# Altium schematic sheet Power_driver_power.SchDoc: Программируемый испочник напряжения
size 420 x 297 mm; ApprovedBy: Kurochkin; CheckedBy: Pavlov; Author: Ponomarev; CompanyName: RQC; DocumentNumber: РТСБ.XXXXXX.XXX Э3; SheetNumber: 1; SheetTotal: 2; DocumentType: Схема электрическая принципиальная; FirstReferrence: АБВГ.123456.001
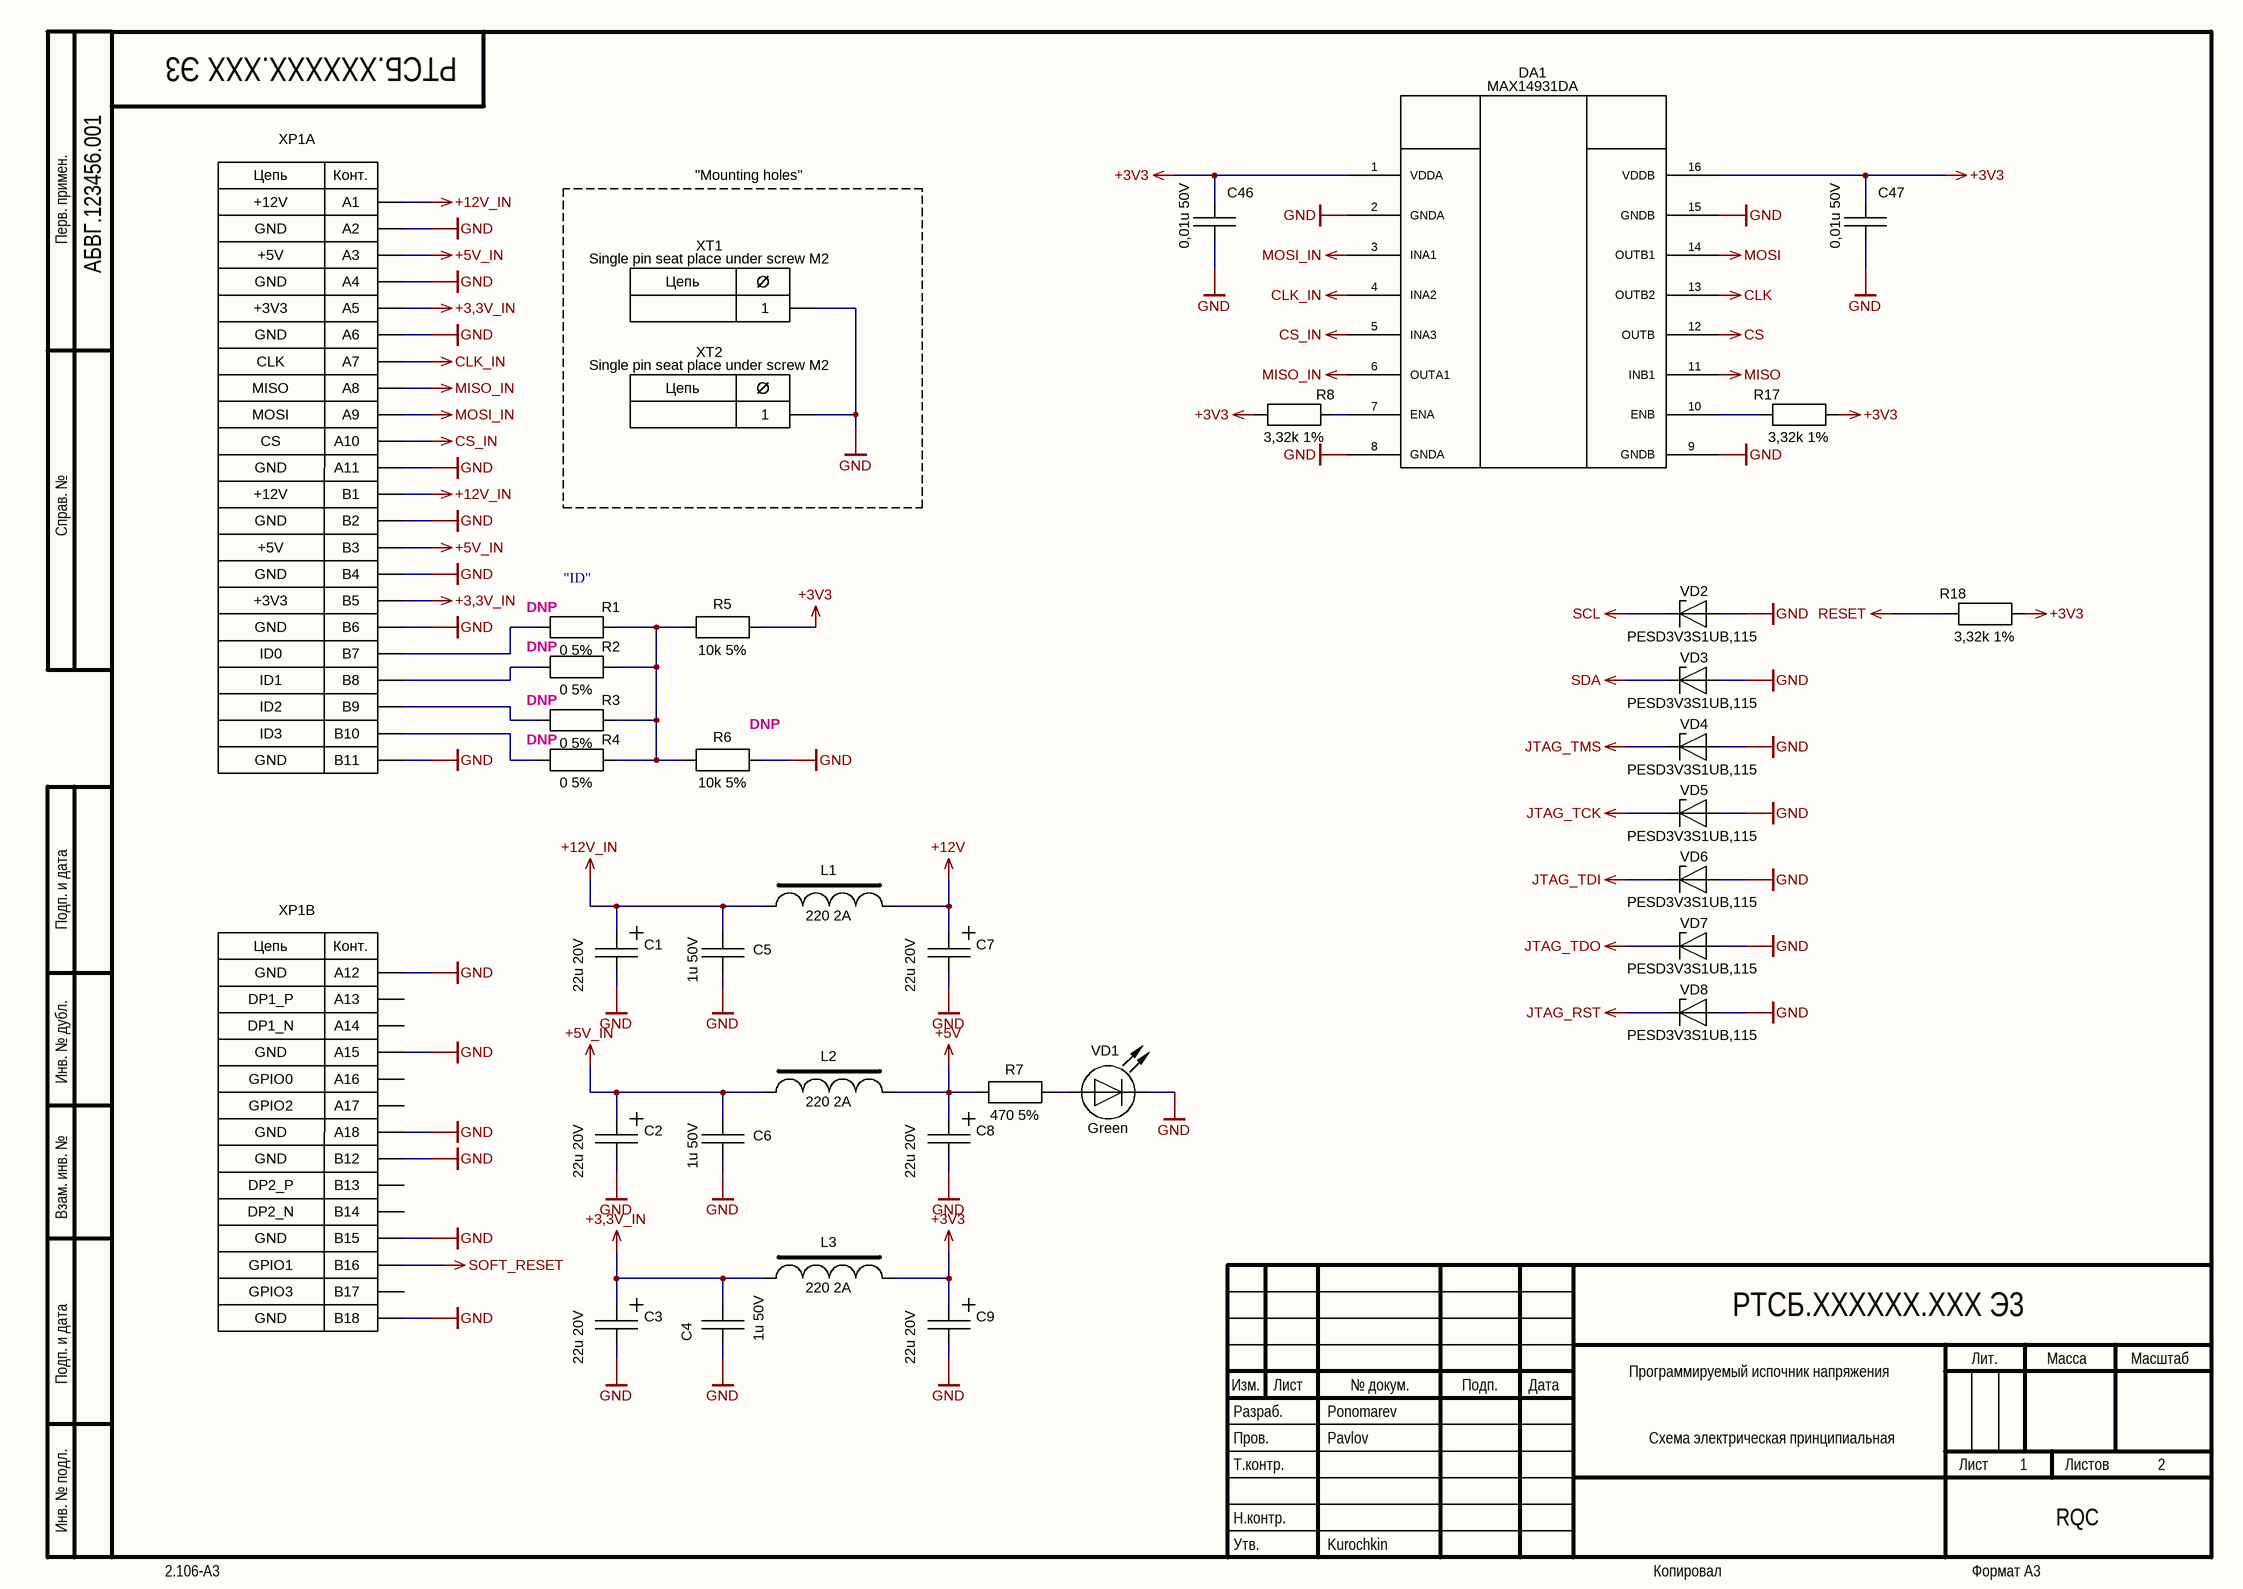
[diagram p0: Power_driver_power.SchDoc]

## Parts
C1  22u 20V  [B_CAPMP3528X21N]
C2  22u 20V  [B_CAPMP3528X21N]
C3  22u 20V  [B_CAPMP3528X21N]
C4  1u 50V  [C0603_CAPC1608X09N]
C5  1u 50V  [C0603_CAPC1608X09N]
C6  1u 50V  [C0603_CAPC1608X09N]
C7  22u 20V  [B_CAPMP3528X21N]
C8  22u 20V  [B_CAPMP3528X21N]
C9  22u 20V  [B_CAPMP3528X21N]
C46  0,01u 50V  [C0603_CAPC1608X09N]
C47  0,01u 50V  [C0603_CAPC1608X09N]
DA1  MAX14931DA  [SOIC127P740X110-16N]
L1  220 2A  [I0805_INDC2012X11N]
L2  220 2A  [I0805_INDC2012X11N]
L3  220 2A  [I0805_INDC2012X11N]
R1  0 5%  Staff: DNP  [R0603_RESC1608X06N]
R2  0 5%  Staff: DNP  [R0603_RESC1608X06N]
R3  0 5%  Staff: DNP  [R0603_RESC1608X06N]
R4  0 5%  Staff: DNP  [R0603_RESC1608X06N]
R5  10k 5%  [R0603_RESC1608X06N]
R6  10k 5%  Staff: DNP  [R0603_RESC1608X06N]
R7  470 5%  [R0603_RESC1608X06N]
R8  3,32k 1%  [R0603_RESC1608X06N]
R17  3,32k 1%  [R0603_RESC1608X06N]
R18  3,32k 1%  [R0603_RESC1608X06N]
VD1  Green  [LED3010X012]
VD2  PESD3V3S1UB,115  [SOD523_SODFL160X65-2N]
VD3  PESD3V3S1UB,115  [SOD523_SODFL160X65-2N]
VD4  PESD3V3S1UB,115  [SOD523_SODFL160X65-2N]
VD5  PESD3V3S1UB,115  [SOD523_SODFL160X65-2N]
VD6  PESD3V3S1UB,115  [SOD523_SODFL160X65-2N]
VD7  PESD3V3S1UB,115  [SOD523_SODFL160X65-2N]
VD8  PESD3V3S1UB,115  [SOD523_SODFL160X65-2N]
XP1  (no value)  [PCI_EXP_36_EDGE_mod]  (parts A,B of 2)  (no BOM)
XT1  Single pin seat place under screw M2  [S_MOUNT_M2]
XT2  Single pin seat place under screw M2  [S_MOUNT_M2]

## Blocks framed on the sheet
"Mounting holes": XT1 XT2

## Nets
+3,3V_IN: C3.1 C4.2 L3.1 XP1.A5 XP1.B5
+3V3: C9.1 C46.1 C47.1 DA1.1(VDDA) DA1.16(VDDB) L3.2 R5.2 R8.1 R17.1 R18.1
+5V: C8.1 L2.2 R7.1
+5V_IN: C2.1 C6.2 L2.1 XP1.A3 XP1.B3
+12V: C7.1 L1.2
+12V_IN: C1.1 C5.2 L1.1 XP1.A1 XP1.B1
CLK: DA1.13(OUTB2)
CLK_IN: DA1.4(INA2) XP1.A7
CS: DA1.12(OUTB)
CS_IN: DA1.5(INA3) XP1.A10
GND: C1.2 C2.2 C3.2 C4.1 C5.1 C6.1 C7.2 C8.2 C9.2 C46.2 C47.2 DA1.2(GNDA) DA1.8(GNDA) DA1.9(GNDB) DA1.15(GNDB) R6.2 VD1.1(K) VD2.2(A) VD3.2(A) VD4.2(A) VD5.2(A) VD6.2(A) VD7.2(A) VD8.2(A) XP1.A2 XP1.A4 XP1.A6 XP1.A11 XP1.A12 XP1.A15 XP1.A18 XP1.B2 XP1.B4 XP1.B6 XP1.B11 XP1.B12 XP1.B15 XP1.B18 XT1.1 XT2.1
JTAG_RST: VD8.1(K)
JTAG_TCK: VD5.1(K)
JTAG_TDI: VD6.1(K)
JTAG_TDO: VD7.1(K)
JTAG_TMS: VD4.1(K)
MISO: DA1.11(INB1)
MISO_IN: DA1.6(OUTA1) XP1.A8
MOSI: DA1.14(OUTB1)
MOSI_IN: DA1.3(INA1) XP1.A9
RESET: R18.2
SCL: VD2.1(K)
SDA: VD3.1(K)
SOFT_RESET: XP1.B16
NetDA1_7: DA1.7(ENA) R8.2
NetDA1_10: DA1.10(ENB) R17.2
NetR1_1: R1.1 XP1.B7
NetR1_2: R1.2 R2.2 R3.2 R4.2 R5.1 R6.1
NetR2_1: R2.1 XP1.B8
NetR3_1: R3.1 XP1.B9
NetR4_1: R4.1 XP1.B10
NetR7_2: R7.2 VD1.2(A)

Not connected (* = marked no-connect by the designer): XP1 A13 A14 A16 A17 B13 B14 B17

## Notes on the sheet
- (near R1) "ID"
- Перв. примен.
- Справ. №
- Подп. и дата
- Инв. № дубл.
- Взам. инв. №
- Разраб.
- Изм.
- Лист
- № докум.
- Подп.
- Дата
- Лит.
- Масса
- Масштаб
- Пров.
- Т.контр.
- Листов
- Инв. № подл.
- Утв.
- Н.контр.
- 2.106-A3
- Копировал
- Формат А3
- (in symbol PCI_EXP_36_EDGE_mod, part A) Цепь; Конт.; +12V; GND; +5V; +3V3; CLK; MISO; MOSI; CS; ID0; ID1; ID2; ID3
- (in symbol PCI_EXP_36_EDGE_mod, part B) Цепь; Конт.; GND; DP1_P; DP1_N; GPIO0; GPIO2; DP2_P; DP2_N; GPIO1; GPIO3
- (in symbol S_MOUNT_M2) Цепь

## Library data of the parts
C1-C3 C7-C9 = 293D226X9020B2TE3: Solid Tantalum Capacitor, General purpose, Surface Mount; Manufacturer: Vishay; ValueBOM: 22мкФ ±10% 20В 2,1Ом Tantal B; ModelSTEP: Z:\LIB\ALTIUM\MODEL\STEP\Capacitor\B_CAPMP3528X21.Step; Designer: Dudarev; EOL: NO; PartNumber: 293D226X9020B2TE3; ValueSCH: 22u 20V; Mount: SMT; HelpURL: Z:\LIB\ALTIUM\INFO\Capacitor\Vishay293d-2.pdf; Modify: 28.06.2016
C4-C6 = CC0603KRX7R9BB105: Конденсатор керамический (MLCC) общего назначения 0603; Manufacturer: YAGEO; ValueBOM: 1мкФ ±10% 50В X7R 0603; ModelSTEP: Z:\LIB\ALTIUM\MODEL\STEP\Capacitor\C0603_CAPC1608X09.Step; Designer: Dudarev; EOL: NO; PartNumber: CC0603KRX7R9BB105; ValueSCH: 1u 50V; Mount: SMT; HelpURL: Z:\LIB\ALTIUM\INFO\Capacitor\UPY-GPHC_X7R_6.3V-to-50V_13.pdf; Modify: 28.06.2016
C46 C47 = CC0603KRX7R9BB103: Конденсатор керамический (MLCC) общего назначения 0603; Manufacturer: YAGEO; ValueBOM: 0,01мкФ ±10% 50В X7R 0603; ModelSTEP: Z:\LIB\ALTIUM\MODEL\STEP\Capacitor\C0603_CAPC1608X09.Step; Designer: Dudarev; EOL: NO; PartNumber: CC0603KRX7R9BB103; ValueSCH: 0,01u 50V; Mount: SMT; HelpURL: Z:\LIB\ALTIUM\INFO\Capacitor\UPY-GPHC_X7R_6.3V-to-50V_13.pdf; Modify: 28.06.2016
DA1 = MAX14931DA: 4-Channel, 1kVRMS, 2.75kVRMS, / and 3.75kVRMS Digital Isolators
L1-L3 = BLM21PG221SN1D: Chip Ferrite Bead 220 Ohm, 2A, 0805; Manufacturer: Murata Electronics; ModelSTEP: Z:\LIB\ALTIUM\MODEL\STEP\Inductor\I0805_INDC2012X11.Step; Designer: Pashinskiy; EOL: NO; PartNumber: BLM21PG221SN1D; ValueBOM: BLM21PG221SN1D; ValueSCH: 220 2A; Mount: SMT; HelpURL: Z:\LIB\ALTIUM\INFO\Inductor\Chip%20Ferrite%20Bead%20BLM21P%200805.pdf; Modify: 16.08.2016
R1-R4 = RC0603JR-070RL: Резистор толстопленочный общего назначения 0603; Manufacturer: YAGEO; ValueBOM: 0Ом 5% 75В 300ppm 0603; ModelSTEP: Z:\LIB\ALTIUM\MODEL\STEP\Resistor\R0603_RESC1005X04.step; Designer: Dudarev; EOL: NO; PartNumber: RC0603JR-070RL; ValueSCH: 0 5%; Mount: SMT; HelpURL: Z:\LIB\ALTIUM\INFO\Resistor\YAGEO\Lead free chip resistors RC_P.pdf; Modify: 28.06.2016
R5 R6 = RC0603JR-0710KL: Резистор толстопленочный общего назначения 0603; Manufacturer: YAGEO; ValueBOM: 10кОм 5% 75В 150ppm 0603; ModelSTEP: Z:\LIB\ALTIUM\MODEL\STEP\Resistor\R0603_RESC1005X04.step; Designer: Dudarev; EOL: NO; PartNumber: RC0603JR-0710KL; ValueSCH: 10k 5%; Mount: SMT; HelpURL: Z:\LIB\ALTIUM\INFO\Resistor\YAGEO\Lead free chip resistors RC_P.pdf; Modify: 28.06.2016
R7 = RC0603JR-07470RL: Резистор толстопленочный общего назначения 0603; Manufacturer: YAGEO; ValueBOM: 470Ом 5% 75В 150ppm 0603; ModelSTEP: Z:\LIB\ALTIUM\MODEL\STEP\Resistor\R0603_RESC1005X04.step; Designer: Dudarev; EOL: NO; PartNumber: RC0603JR-07470RL; ValueSCH: 470 5%; Mount: SMT; HelpURL: Z:\LIB\ALTIUM\INFO\Resistor\YAGEO\Lead free chip resistors RC_P.pdf; Modify: 28.06.2016
R8 R17 R18 = RC0603FR-073K32L: Резистор толстопленочный общего назначения 0603; Manufacturer: YAGEO; ValueBOM: 3,32кОм 1% 75В 150ppm 0603; ModelSTEP: Z:\LIB\ALTIUM\MODEL\STEP\Resistor\R0603_RESC1005X04.step; Designer: Dudarev; EOL: NO; PartNumber: RC0603FR-073K32L; ValueSCH: 3,32k 1%; Mount: SMT; HelpURL: Z:\LIB\ALTIUM\INFO\Resistor\YAGEO\Lead free chip resistors RC_P.pdf; Modify: 28.06.2016
VD1 = 155124VS73200: LED SMD Right Angle Bright Green 3mm x 1mm (1204); Manufacturer: Wurth Elektronik; ModelSTEP: Z:\LIB\ALTIUM\MODEL\STEP\LED\WL-SMSW_1204_round.step; Designer: Dudarev; EOL: NO; PartNumber: 155124VS73200; ValueBOM: 155124VS73200; ValueSCH: Green; Mount: SMT; HelpURL: Z:\LIB\ALTIUM\INFO\LED\155124VS73200.pdf; Modify: 08.06.2016
VD2-VD8 = PESD3V3S1UB,115: Transient Voltage Suppressor, 3.3V, Unidirectional,  SOD-523; Manufacturer: NXP; ModelSTEP: Z:\LIB\ALTIUM\MODEL\STEP\Suppressor\SOD523.Step; Designer: Pashinskiy; EOL: NO; PartNumber: PESD3V3S1UB,115; ValueBOM: PESD3V3S1UB,115; ValueSCH: PESD3V3S1UB,115; Mount: SMT; HelpURL: Z:\LIB\ALTIUM\INFO\Suppressor\PESDXS1UB_SERIES.pdf; Modify: 23.11.2016
XP1 = PCI_EXP_36_EDGE_mod: PCI Express connector 36 circuits
XT1 XT2 = S_MOUNT_M2: Manufacturer: RQC; ValueBOM: Отверстие под винт М2; Designer: Pashinskiy; EOL: NO; PartNumber: S_MOUNT_M2; ValueSCH: Single pin seat place under screw M2; Mount: -; Modify: 16.09.2016